# EAGLE design edisonLightColor (EAGLE 7.0.0)
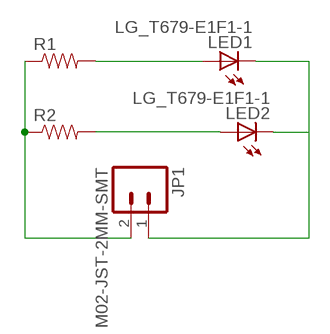
[diagram p0: schematic, sheet 1]

## Parts
JP1  M02-JST-2MM-SMT  [JST-2-SMD]
LED1  LG_T679-E1F1-1  [PLCC2]
LED2  LG_T679-E1F1-1  [PLCC2]
R1  RESISTOR0805-RES  [0805]
R2  RESISTOR0805-RES  [0805]

## Nets
N$1: LED2.A R2.2
N$2: JP1.1 LED1.C LED2.C
N$3: JP1.2 R1.1 R2.1
N$12: LED1.A R1.2

## Library data of the parts
JP1 = SparkFun-Connectors:M02: Standard 2-pin 0.1" header. Use with - straight break away headers ( PRT-00116) - right angle break away headers (PRT-00553) - swiss pins (PRT-00743) - machine pins (PRT-00117) - female headers (PRT-00115) Molex polarized connector foot print use with: PRT-08233 with associated crimp pins and housings. 2.54_SCREWTERM for use with PRT-10571. 3.5mm Screw Terminal footprints for PRT-08084 5mm Screw Terminal footprints for use with PRT-08432; PROD_ID: CONN-08352
LED1 LED2 = led:*_T679-?-1: LC TOPLED® Low Current LED Source: http://catalog.osram-os.com .. LG_LS_LY_T679_OBS.pdf; COLOR: green
R1 R2 = SparkFun-Resistors:RESISTOR: Resistor Basic schematic elements and footprints for 0603, 1206, and PTH resistors.

## Board
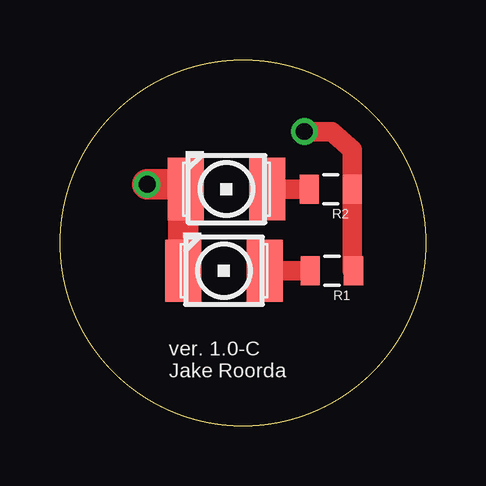
[diagram p1: board, top side]
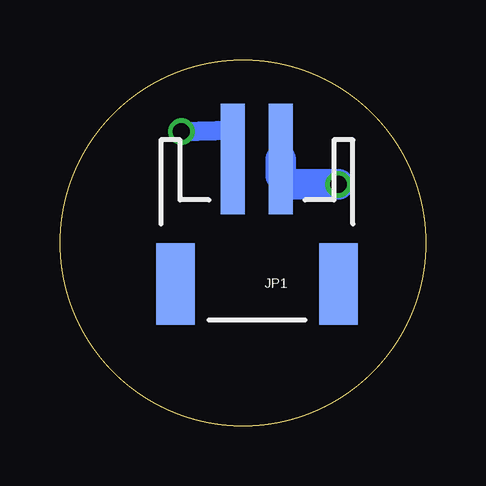
[diagram p2: board, bottom side, seen from below]

Size 15.24 x 15.24 mm. Coordinates in mm from the lower left corner, seen from the top.
Outline: circle at 7.62,7.62 radius 7.62
Copper layers (1*16): Top 0.035mm / dielectric 1.5mm / Bottom 0.035mm
Design rules "default": minimum track width 10mil, minimum drill 24mil, track to track 8mil, track to pad 8mil, pad to pad 8mil, via to via 8mil, smd to smd 8mil, copper to edge 40mil, drill to drill 8mil, minimum pad ring 10mil, minimum via ring 8mil, stop-mask expansion 4mil, vias tented up to drill 0mil, thermal gap 10mil

### Footprints (pad centres in the part's own frame; a part is rotated, then mirrored left to right if it is on the bottom)
JST-2-SMD = smd 1 x 4.6: 1 -1,-3.7; 2 1,-3.7 | smd 1.6 x 3.4: NC1 -3.4,1.5; NC2 3.4,1.5
PLCC2 = smd 2.6 x 1.5: A 0,1.7; C 0,-1.7
0805 = smd 0.8 x 1.2: 1 -0.9,0; 2 0.9,0

### Placement (x,y rotation side)
JP1  7.03,7.41 180 bottom
LED1  6.83,6.46 270 top
LED2  6.93,9.86 270 top
R1  11.33,6.46 180 top
R2  11.28,9.86 180 top

### Tracks (layer width: path | path; a pad name or v marks a point on that pad's centre or on a via)
N$1
  Top 0.813: LED2.A R2.2
N$2  (via drill 0.7)
  Top 1.27: v3.63,10.06 5.18,10.06 5.23,10.01 LED2.C 5.13,9.86 LED1.C
  Bottom 1.27: v3.63,10.06 5.68,10.06 6.03,10.41 JP1.1
N$3  (via drill 0.7)
  Top 0.813: R1.1 12.18,6.46 R2.1 12.18,11.51 11.33,12.26 v10.18,12.26 10.23,12.21
  Bottom 0.813: JP1.2 8.03,12.31 v10.18,12.26
N$12
  Top 0.813: LED1.A R1.2

### Text on the board
tPlace: ver. 1.0-C / Jake Roorda